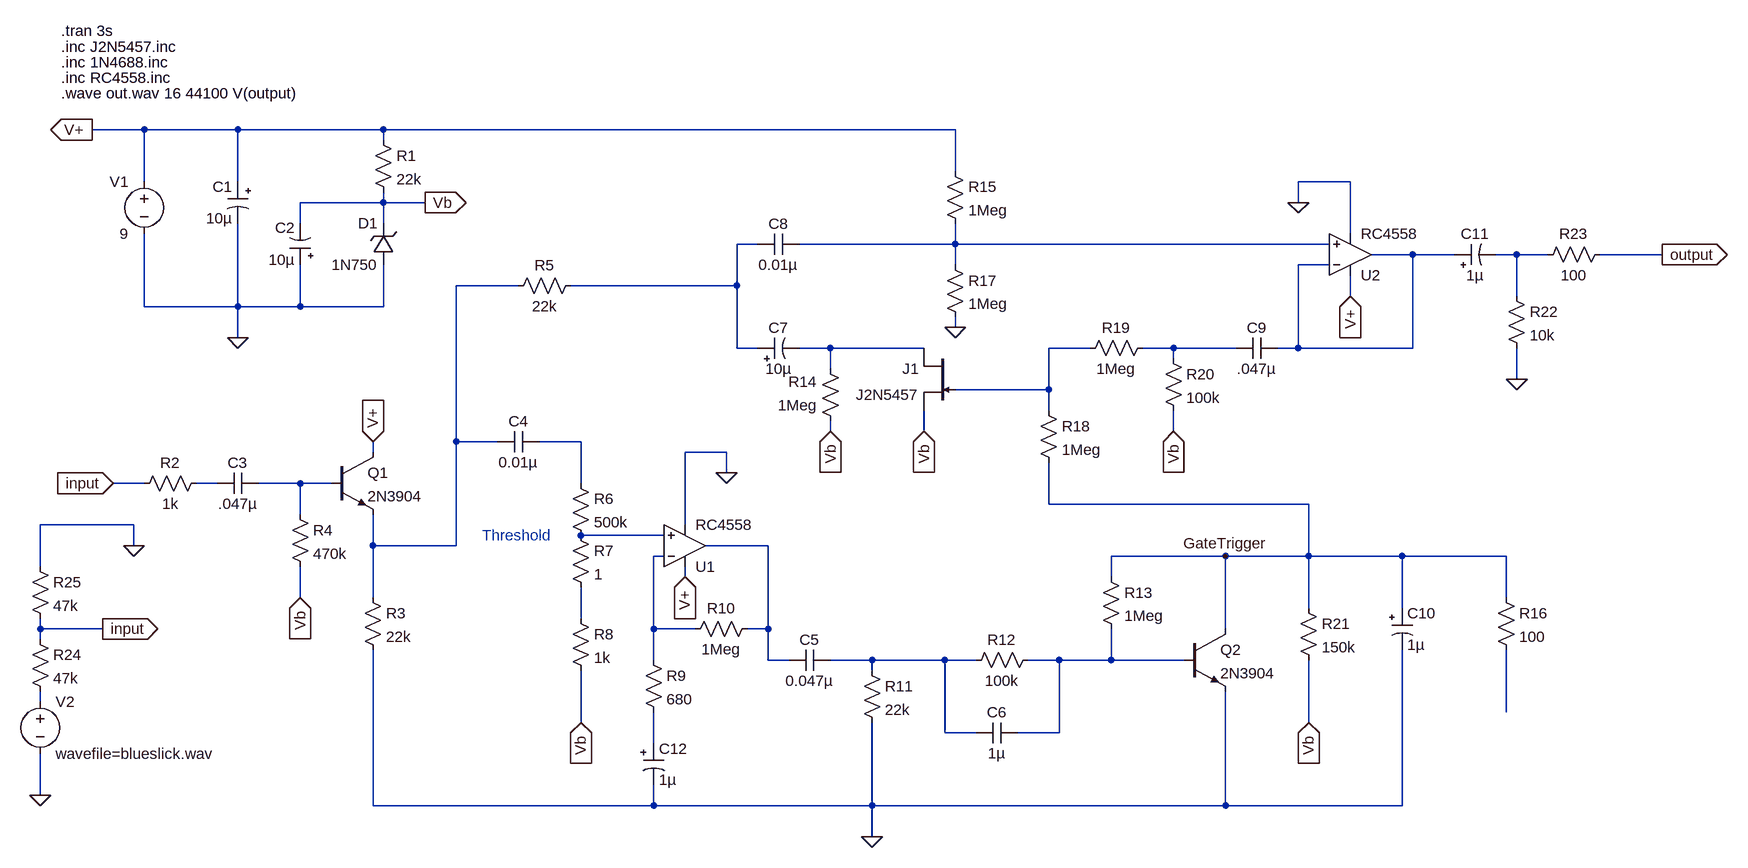
[diagram p0: schematic MXR Noise Gate.asc]
MXR Noise Gate.asc, the LTspice schematic file:
Version 4
SHEET 1 880 680
WIRE -2912 -1776 -2992 -1776
WIRE -2768 -1776 -2912 -1776
WIRE -2544 -1776 -2768 -1776
WIRE -1664 -1776 -2544 -1776
WIRE -2544 -1760 -2544 -1776
WIRE -1664 -1712 -1664 -1776
WIRE -2912 -1696 -2912 -1776
WIRE -2768 -1696 -2768 -1776
WIRE -1056 -1696 -1136 -1696
WIRE -2544 -1664 -2544 -1680
WIRE -2544 -1664 -2672 -1664
WIRE -2480 -1664 -2544 -1664
WIRE -1136 -1664 -1136 -1696
WIRE -2672 -1632 -2672 -1664
WIRE -2544 -1632 -2544 -1664
WIRE -1056 -1616 -1056 -1696
WIRE -1968 -1600 -2000 -1600
WIRE -1664 -1600 -1664 -1632
WIRE -1664 -1600 -1904 -1600
WIRE -1088 -1600 -1664 -1600
WIRE -960 -1584 -1024 -1584
WIRE -896 -1584 -960 -1584
WIRE -800 -1584 -832 -1584
WIRE -752 -1584 -800 -1584
WIRE -576 -1584 -672 -1584
WIRE -1664 -1568 -1664 -1600
WIRE -1088 -1568 -1136 -1568
WIRE -2336 -1536 -2432 -1536
WIRE -2000 -1536 -2000 -1600
WIRE -2000 -1536 -2256 -1536
WIRE -1056 -1520 -1056 -1552
WIRE -800 -1520 -800 -1584
WIRE -2912 -1504 -2912 -1616
WIRE -2768 -1504 -2768 -1632
WIRE -2768 -1504 -2912 -1504
WIRE -2672 -1504 -2672 -1568
WIRE -2672 -1504 -2768 -1504
WIRE -2544 -1504 -2544 -1568
WIRE -2544 -1504 -2672 -1504
WIRE -1664 -1472 -1664 -1488
WIRE -2768 -1456 -2768 -1504
WIRE -2000 -1440 -2000 -1536
WIRE -1968 -1440 -2000 -1440
WIRE -1856 -1440 -1904 -1440
WIRE -1712 -1440 -1856 -1440
WIRE -1456 -1440 -1520 -1440
WIRE -1328 -1440 -1376 -1440
WIRE -1232 -1440 -1328 -1440
WIRE -1136 -1440 -1136 -1568
WIRE -1136 -1440 -1168 -1440
WIRE -960 -1440 -960 -1584
WIRE -960 -1440 -1136 -1440
WIRE -1328 -1424 -1328 -1440
WIRE -1856 -1408 -1856 -1440
WIRE -800 -1392 -800 -1440
WIRE -1520 -1376 -1520 -1440
WIRE -1520 -1376 -1664 -1376
WIRE -1520 -1344 -1520 -1376
WIRE -1856 -1312 -1856 -1328
WIRE -1712 -1312 -1712 -1344
WIRE -1328 -1312 -1328 -1344
WIRE -2432 -1296 -2432 -1536
WIRE -2368 -1296 -2432 -1296
WIRE -2240 -1296 -2304 -1296
WIRE -2560 -1280 -2560 -1296
WIRE -2016 -1280 -2080 -1280
WIRE -2016 -1248 -2016 -1280
WIRE -2912 -1232 -2960 -1232
WIRE -2800 -1232 -2832 -1232
WIRE -2672 -1232 -2736 -1232
WIRE -2624 -1232 -2672 -1232
WIRE -2240 -1232 -2240 -1296
WIRE -1520 -1200 -1520 -1264
WIRE -1120 -1200 -1520 -1200
WIRE -2672 -1184 -2672 -1232
WIRE -2928 -1168 -3072 -1168
WIRE -2080 -1168 -2080 -1280
WIRE -2112 -1152 -2240 -1152
WIRE -2928 -1136 -2928 -1168
WIRE -2560 -1136 -2560 -1184
WIRE -2432 -1136 -2432 -1296
WIRE -2432 -1136 -2560 -1136
WIRE -1952 -1136 -2048 -1136
WIRE -2112 -1120 -2128 -1120
WIRE -1248 -1120 -1424 -1120
WIRE -1120 -1120 -1120 -1200
WIRE -1120 -1120 -1248 -1120
WIRE -976 -1120 -1120 -1120
WIRE -816 -1120 -976 -1120
WIRE -3072 -1104 -3072 -1168
WIRE -2080 -1088 -2080 -1104
WIRE -1424 -1088 -1424 -1120
WIRE -2672 -1056 -2672 -1104
WIRE -2560 -1056 -2560 -1136
WIRE -816 -1056 -816 -1120
WIRE -1120 -1040 -1120 -1120
WIRE -976 -1040 -976 -1120
WIRE -2240 -1024 -2240 -1072
WIRE -3072 -1008 -3072 -1024
WIRE -2976 -1008 -3072 -1008
WIRE -2128 -1008 -2128 -1120
WIRE -2064 -1008 -2128 -1008
WIRE -1952 -1008 -1952 -1136
WIRE -1952 -1008 -1984 -1008
WIRE -1248 -1008 -1248 -1120
WIRE -3072 -992 -3072 -1008
WIRE -2128 -960 -2128 -1008
WIRE -1952 -960 -1952 -1008
WIRE -1920 -960 -1952 -960
WIRE -1792 -960 -1856 -960
WIRE -1680 -960 -1792 -960
WIRE -1632 -960 -1680 -960
WIRE -1504 -960 -1552 -960
WIRE -1424 -960 -1424 -1008
WIRE -1424 -960 -1504 -960
WIRE -1312 -960 -1424 -960
WIRE -1792 -944 -1792 -960
WIRE -3072 -896 -3072 -912
WIRE -816 -880 -816 -976
WIRE -2240 -864 -2240 -944
WIRE -1120 -864 -1120 -960
WIRE -1680 -848 -1680 -960
WIRE -1632 -848 -1680 -848
WIRE -1504 -848 -1504 -960
WIRE -1504 -848 -1568 -848
WIRE -2128 -832 -2128 -880
WIRE -3072 -752 -3072 -816
WIRE -2560 -736 -2560 -976
WIRE -2128 -736 -2128 -768
WIRE -2128 -736 -2560 -736
WIRE -1792 -736 -1792 -864
WIRE -1792 -736 -2128 -736
WIRE -1248 -736 -1248 -912
WIRE -1248 -736 -1792 -736
WIRE -976 -736 -976 -976
WIRE -976 -736 -1248 -736
WIRE -1792 -688 -1792 -736
FLAG -2480 -1664 Vb
IOPIN -2480 -1664 Out
FLAG -2960 -1232 input
IOPIN -2960 -1232 In
FLAG -2992 -1776 V+
IOPIN -2992 -1776 Out
FLAG -2560 -1296 V+
IOPIN -2560 -1296 In
FLAG -2672 -1056 Vb
IOPIN -2672 -1056 In
FLAG -2240 -864 Vb
IOPIN -2240 -864 In
FLAG -1664 -1472 0
FLAG -1856 -1312 Vb
IOPIN -1856 -1312 In
FLAG -1712 -1312 Vb
IOPIN -1712 -1312 In
FLAG -1328 -1312 Vb
IOPIN -1328 -1312 In
FLAG -1120 -864 Vb
IOPIN -1120 -864 In
FLAG -1056 -1520 V+
IOPIN -1056 -1520 In
FLAG -1136 -1664 0
FLAG -800 -1392 0
FLAG -576 -1584 output
IOPIN -576 -1584 Out
FLAG -1792 -688 0
FLAG -2768 -1456 0
FLAG -3072 -752 0
FLAG -2016 -1248 0
FLAG -2080 -1088 V+
IOPIN -2080 -1088 In
FLAG -2928 -1136 0
FLAG -2976 -1008 input
IOPIN -2976 -1008 Out
FLAG -1248 -1120 GateTrigger
SYMBOL voltage -2912 -1712 M0
WINDOW 123 0 0 Left 2
WINDOW 39 0 0 Left 2
SYMATTR InstName V1
SYMATTR Value 9
SYMBOL polcap -2752 -1696 M0
SYMATTR InstName C1
SYMATTR Value 10µ
SYMBOL res -2560 -1776 R0
SYMATTR InstName R1
SYMATTR Value 22k
SYMBOL polcap -2656 -1568 R180
WINDOW 0 24 57 Left 2
WINDOW 3 24 8 Left 2
SYMATTR InstName C2
SYMATTR Value 10µ
SYMBOL res -2816 -1248 R90
WINDOW 0 0 56 VBottom 2
WINDOW 3 32 56 VTop 2
SYMATTR InstName R2
SYMATTR Value 1k
SYMBOL npn -2624 -1280 R0
SYMATTR InstName Q1
SYMATTR Value 2N3904
SYMBOL res -2576 -1072 R0
SYMATTR InstName R3
SYMATTR Value 22k
SYMBOL res -2688 -1200 R0
SYMATTR InstName R4
SYMATTR Value 470k
SYMBOL cap -2304 -1312 R90
WINDOW 0 0 32 VBottom 2
WINDOW 3 32 32 VTop 2
SYMATTR InstName C4
SYMATTR Value 0.01µ
SYMBOL res -2240 -1552 R90
WINDOW 0 0 56 VBottom 2
WINDOW 3 32 56 VTop 2
SYMATTR InstName R5
SYMATTR Value 22k
SYMBOL res -2256 -1248 R0
SYMATTR InstName R6
SYMATTR Value 500k
SYMBOL res -2256 -1168 R0
SYMATTR InstName R7
SYMATTR Value 1
SYMBOL res -2256 -1040 R0
SYMATTR InstName R8
SYMATTR Value 1k
SYMBOL Opamps\\opamp2 -2080 -1072 M180
SYMATTR InstName U1
SYMATTR Value RC4558
SYMBOL res -1968 -1024 R90
WINDOW 0 0 56 VBottom 2
WINDOW 3 32 56 VTop 2
SYMATTR InstName R10
SYMATTR Value 1Meg
SYMBOL cap -1856 -976 R90
WINDOW 0 0 32 VBottom 2
WINDOW 3 32 32 VTop 2
SYMATTR InstName C5
SYMATTR Value 0.047µ
SYMBOL res -1808 -960 R0
SYMATTR InstName R11
SYMATTR Value 22k
SYMBOL res -1536 -976 R90
WINDOW 0 0 56 VBottom 2
WINDOW 3 32 56 VTop 2
SYMATTR InstName R12
SYMATTR Value 100k
SYMBOL cap -1568 -864 R90
WINDOW 0 0 32 VBottom 2
WINDOW 3 32 32 VTop 2
SYMATTR InstName C6
SYMATTR Value 1µ
SYMBOL res -1440 -1104 R0
SYMATTR InstName R13
SYMATTR Value 1Meg
SYMBOL npn -1312 -1008 R0
SYMATTR InstName Q2
SYMATTR Value 2N3904
SYMBOL polcap -1968 -1424 R270
WINDOW 0 32 32 VTop 2
WINDOW 3 0 32 VBottom 2
SYMATTR InstName C7
SYMATTR Value 10µ
SYMBOL cap -1904 -1616 R90
WINDOW 0 0 32 VBottom 2
WINDOW 3 32 32 VTop 2
SYMATTR InstName C8
SYMATTR Value 0.01µ
SYMBOL res -1840 -1312 R180
WINDOW 0 36 76 Left 2
WINDOW 3 36 40 Left 2
SYMATTR InstName R14
SYMATTR Value 1Meg
SYMBOL res -1680 -1728 R0
SYMATTR InstName R15
SYMATTR Value 1Meg
SYMBOL res -1680 -1584 R0
SYMATTR InstName R17
SYMATTR Value 1Meg
SYMBOL njf -1664 -1440 M0
SYMATTR InstName J1
SYMATTR Value J2N5457
SYMBOL res -1536 -1360 R0
SYMATTR InstName R18
SYMATTR Value 1Meg
SYMBOL res -1360 -1456 R90
WINDOW 0 0 56 VBottom 2
WINDOW 3 32 56 VTop 2
SYMATTR InstName R19
SYMATTR Value 1Meg
SYMBOL res -1344 -1440 R0
SYMATTR InstName R20
SYMATTR Value 100k
SYMBOL cap -2736 -1248 R90
WINDOW 0 0 32 VBottom 2
WINDOW 3 32 32 VTop 2
SYMATTR InstName C3
SYMATTR Value .047µ
SYMBOL res -1136 -1056 R0
SYMATTR InstName R21
SYMATTR Value 150k
SYMBOL cap -1168 -1456 R90
WINDOW 0 0 32 VBottom 2
WINDOW 3 32 32 VTop 2
SYMATTR InstName C9
SYMATTR Value .047µ
SYMBOL polcap -992 -1040 R0
SYMATTR InstName C10
SYMATTR Value 1µ
SYMBOL Opamps\\opamp2 -1056 -1520 M180
SYMATTR InstName U2
SYMATTR Value RC4558
SYMATTR SpiceModel RC4558
SYMBOL polcap -896 -1568 R270
WINDOW 0 32 32 VTop 2
WINDOW 3 0 32 VBottom 2
SYMATTR InstName C11
SYMATTR Value 1µ
SYMBOL res -816 -1536 R0
SYMATTR InstName R22
SYMATTR Value 10k
SYMBOL res -656 -1600 R90
WINDOW 0 0 56 VBottom 2
WINDOW 3 32 56 VTop 2
SYMATTR InstName R23
SYMATTR Value 100
SYMBOL voltage -3072 -912 R0
SYMATTR InstName V2
SYMATTR Value wavefile=blueslick.wav
SYMBOL res -832 -1072 R0
SYMATTR InstName R16
SYMATTR Value 100
SYMBOL res -2144 -976 R0
SYMATTR InstName R9
SYMATTR Value 680
SYMBOL polcap -2144 -832 R0
SYMATTR InstName C12
SYMATTR Value 1µ
SYMBOL res -3088 -1008 R0
SYMATTR InstName R24
SYMATTR Value 47k
SYMBOL res -3088 -1120 R0
SYMATTR InstName R25
SYMATTR Value 47k
SYMBOL zener -2528 -1568 R180
WINDOW 0 24 64 Left 2
WINDOW 3 24 0 Left 2
SYMATTR InstName D1
SYMATTR Value 1N750
TEXT -2392 -1152 Left 2 ;Threshold
TEXT -3040 -1856 Left 2 !.inc RC4558.inc
TEXT -3040 -1832 Left 2 !.wave out.wav 16 44100 V(output)
TEXT -3040 -1928 Left 2 !.tran 3s
TEXT -3040 -1880 Left 2 !.inc 1N4688.inc
TEXT -3040 -1904 Left 2 !.inc J2N5457.inc

The netlist it stands for:
* MXR Noise Gate.asc
V1 V+ 0 9
C1 V+ 0 10µ
R1 V+ Vb 22k
C2 0 Vb 10µ
R2 N010 input 1k
Q1 V+ N011 N005 0 2N3904
R3 N005 0 22k
R4 N011 Vb 470k
C4 N009 N005 0.01µ
R5 N001 N005 22k
R6 N009 N012 500k
R7 N012 N015 1
R8 N015 Vb 1k
XU1 N012 N014 V+ 0 N013 RC4558  ; pins In+ In- V+ V- OUT
R10 N013 N014 1Meg
C5 N016 N013 0.047µ
R11 N016 0 22k
R12 N017 N016 100k
C6 N017 N016 1µ
R13 GateTrigger N017 1Meg
Q2 GateTrigger N017 0 0 2N3904
C7 N001 N006 10µ
C8 N002 N001 0.01µ
R14 Vb N006 1Meg
R15 V+ N002 1Meg
R17 N002 0 1Meg
J1 N006 N007 Vb J2N5457
R18 N007 GateTrigger 1Meg
R19 N008 N007 1Meg
R20 N008 Vb 100k
C3 N011 N010 .047µ
R21 GateTrigger Vb 150k
C9 N003 N008 .047µ
C10 GateTrigger 0 1µ
XU2 N002 N003 V+ 0 N003 RC4558 RC4558  ; pins In+ In- V+ V- OUT
C11 N003 N004 1µ
R22 N004 0 10k
R23 output N004 100
V2 N018 0 wavefile=blueslick.wav
R16 GateTrigger N019 100
R9 N014 N020 680
C12 N020 0 1µ
R24 input N018 47k
R25 0 input 47k
D1 0 Vb 1N750
.model D D
.lib standard.dio
.model NPN NPN
.model PNP PNP
.lib standard.bjt
.model NJF NJF
.model PJF PJF
.lib standard.jft
* Threshold
.inc RC4558.inc
.wave out.wav 16 44100 V(output)
.tran 3s
.inc 1N4688.inc
.inc J2N5457.inc
.backanno
.end